# EAGLE design Breakouts2 (EAGLE 7.4.0)
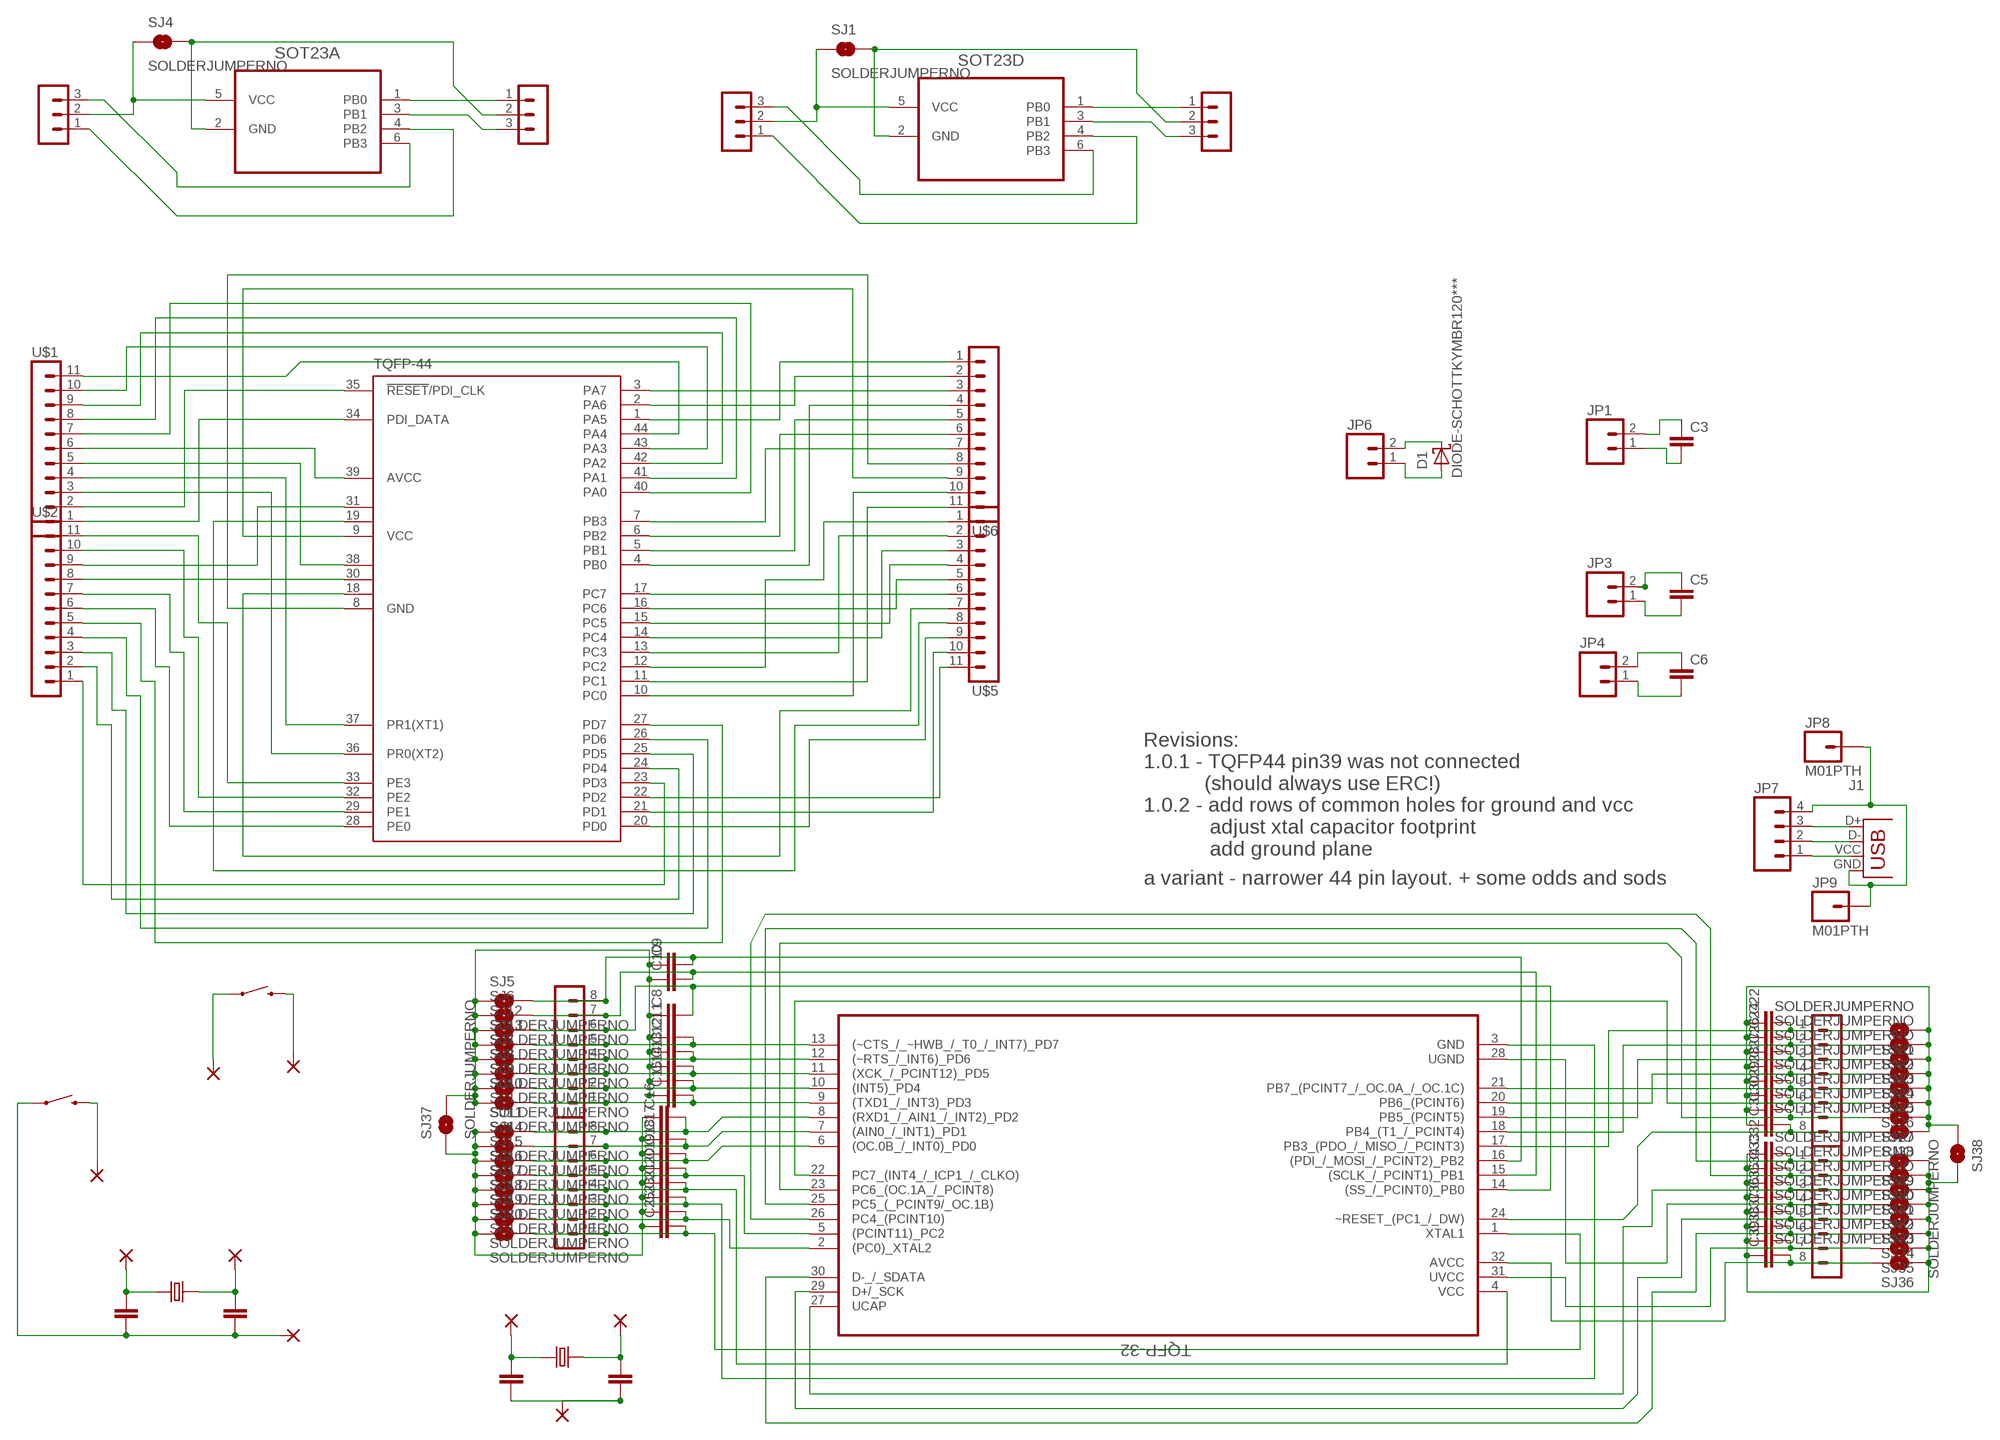
[diagram p0: schematic, sheet 1]

## Parts
C1  C-EU025-024X044**100NF+22PF  [C025-024X044]
C2  C-EU025-024X044**100NF+22PF  [C025-024X044]
C3  C-EU1206  [1206]
C5  C-EU1206  [1206]
C6  C-EU1206  [1206]
C8  C-EU1206  [1206]
C9  C-EU1206  [1206]
C10  C-EU1206  [1206]
C11  C-EU1206  [1206]
C12  C-EU1206  [1206]
C13  C-EU1206  [1206]
C14  C-EU1206  [1206]
C15  C-EU1206  [1206]
C16  C-EU1206  [1206]
C17  C-EU1206  [1206]
C18  C-EU1206  [1206]
C19  C-EU1206  [1206]
C20  C-EU1206  [1206]
C21  C-EU1206  [1206]
C22  C-EU1206  [1206]
C23  C-EU1206  [1206]
C24  C-EU1206  [1206]
C25  C-EU1206  [1206]
C26  C-EU1206  [1206]
C27  C-EU1206  [1206]
C28  C-EU1206  [1206]
C29  C-EU1206  [1206]
C30  C-EU1206  [1206]
C31  C-EU1206  [1206]
C32  C-EU1206  [1206]
C33  C-EU1206  [1206]
C34  C-EU1206  [1206]
C35  C-EU1206  [1206]
C36  C-EU1206  [1206]
C37  C-EU1206  [1206]
C38  C-EU1206  [1206]
C39  C-EU1206  [1206]
C40  C-EU025-024X044**100NF+22PF  [C025-024X044]
C41  C-EU025-024X044**100NF+22PF  [C025-024X044]
D1  DIODE-SCHOTTKYMBR120***  [SOD123]
J1  USB-FCI_SMD***  [FCI_USB_B_SMD]
JP1  M02PTH  [1X02]
JP3  M02PTH  [1X02]
JP4  M02PTH  [1X02]
JP6  M02PTH  [1X02]
JP7  M04PTH  [1X04]
JP8  M01PTH  [1X01]
JP9  M01PTH  [1X01]
PAD1  WIREPAD1,6/0,8  [1,6/0,8]
PAD2  WIREPAD1,6/0,8  [1,6/0,8]
PAD3  WIREPAD1,6/0,8  [1,6/0,8]
PAD4  WIREPAD1,6/0,8  [1,6/0,8]
PAD5  WIREPAD1,6/0,8  [1,6/0,8]
PAD6  WIREPAD1,6/0,8  [1,6/0,8]
PAD7  WIREPAD1,6/0,8  [1,6/0,8]
PAD8  WIREPAD1,6/0,8  [1,6/0,8]
PAD9  WIREPAD1,6/0,8  [1,6/0,8]
S1  SWITCH-MOMENTARY-2PTH  [TACTILE-PTH]
S2  SWITCH-MOMENTARY-2PTH  [TACTILE-PTH]
SJ1  SOLDERJUMPERNO  [SJ_2S-NO]
SJ4  SOLDERJUMPERNO  [SJ_2S-NO]
SJ5  SOLDERJUMPERNO  [SJ_2S-NO]
SJ6  SOLDERJUMPERNO  [SJ_2S-NO]
SJ7  SOLDERJUMPERNO  [SJ_2S-NO]
SJ8  SOLDERJUMPERNO  [SJ_2S-NO]
SJ9  SOLDERJUMPERNO  [SJ_2S-NO]
SJ10  SOLDERJUMPERNO  [SJ_2S-NO]
SJ11  SOLDERJUMPERNO  [SJ_2S-NO]
SJ12  SOLDERJUMPERNO  [SJ_2S-NO]
SJ13  SOLDERJUMPERNO  [SJ_2S-NO]
SJ14  SOLDERJUMPERNO  [SJ_2S-NO]
SJ15  SOLDERJUMPERNO  [SJ_2S-NO]
SJ16  SOLDERJUMPERNO  [SJ_2S-NO]
SJ17  SOLDERJUMPERNO  [SJ_2S-NO]
SJ18  SOLDERJUMPERNO  [SJ_2S-NO]
SJ19  SOLDERJUMPERNO  [SJ_2S-NO]
SJ20  SOLDERJUMPERNO  [SJ_2S-NO]
SJ21  SOLDERJUMPERNO  [SJ_2S-NO]
SJ22  SOLDERJUMPERNO  [SJ_2S-NO]
SJ23  SOLDERJUMPERNO  [SJ_2S-NO]
SJ24  SOLDERJUMPERNO  [SJ_2S-NO]
SJ25  SOLDERJUMPERNO  [SJ_2S-NO]
SJ26  SOLDERJUMPERNO  [SJ_2S-NO]
SJ27  SOLDERJUMPERNO  [SJ_2S-NO]
SJ28  SOLDERJUMPERNO  [SJ_2S-NO]
SJ29  SOLDERJUMPERNO  [SJ_2S-NO]
SJ30  SOLDERJUMPERNO  [SJ_2S-NO]
SJ31  SOLDERJUMPERNO  [SJ_2S-NO]
SJ32  SOLDERJUMPERNO  [SJ_2S-NO]
SJ33  SOLDERJUMPERNO  [SJ_2S-NO]
SJ34  SOLDERJUMPERNO  [SJ_2S-NO]
SJ35  SOLDERJUMPERNO  [SJ_2S-NO]
SJ36  SOLDERJUMPERNO  [SJ_2S-NO]
SJ37  SOLDERJUMPERNO  [SJ_2S-NO]
SJ38  SOLDERJUMPERNO  [SJ_2S-NO]
SOT23A  ATTINY10-TSHR  [SOT95P280X145-6N]
SOT23D  ATTINY10-TSHR  [SOT95P280X145-6N]
SV4  MA08-1  [MA08-1]
SV8  MA08-1  [MA08-1]
SV12  MA03-1  [MA03-1]
SV13  MA03-1  [MA03-1]
SV14  MA03-1  [MA03-1]
SV15  MA03-1  [MA03-1]
SV16  MA08-1  [MA08-1]
SV18  MA08-1  [MA08-1]
TQFP-32  AT90USB162-16AU  [QFP80P900X900X120-32N]
TQFP-44  XMEGA16A4A  [TQFP44]
U$1  MA11-1  [MA11-1S]
U$2  MA11-1  [MA11-1S]
U$5  MA11-1  [MA11-1S]
U$6  MA11-1  [MA11-1S]
X1  CRYSTAL-HC49U-V**16MHZ  [HC49U-V]
X2  CRYSTAL-HC49U-V**16MHZ  [HC49U-V]

## Nets
GND: C1.2 C2.2 PAD8.1(P) S1.1
GND1: PAD4.1(P) S2.1
N$1: TQFP-44.1(PA5) U$6.1
N$2: TQFP-44.2(PA6) U$6.2
N$3: TQFP-44.3(PA7) U$6.3
N$4: TQFP-44.4(PB0) U$6.4
N$5: TQFP-44.5(PB1) U$6.5
N$6: TQFP-44.6(PB2) U$6.6
N$7: TQFP-44.7(PB3) U$6.7
N$8: TQFP-44.8(GND) U$6.8
N$9: TQFP-44.9(VCC) U$6.9
N$10: TQFP-44.12(PC2) U$5.1
N$11: TQFP-44.11(PC1) U$6.11
N$12: TQFP-44.10(PC0) U$6.10
N$13: TQFP-44.13(PC3) U$5.2
N$14: TQFP-44.14(PC4) U$5.3
N$15: TQFP-44.15(PC5) U$5.4
N$16: TQFP-44.16(PC6) U$5.5
N$17: TQFP-44.17(PC7) U$5.6
N$18: TQFP-44.18(GND1) U$5.7
N$19: TQFP-44.19(VCC1) U$5.8
N$20: TQFP-44.20(PD0) U$5.9
N$21: TQFP-44.21(PD1) U$5.10
N$22: TQFP-44.22(PD2) U$5.11
N$23: TQFP-44.23(PD3) U$2.1
N$24: TQFP-44.24(PD4) U$2.2
N$25: C8.1 C9.1 C10.1 C11.1 C12.1 C13.1 C14.1 C15.1 SJ5.1 SJ6.1 SJ7.1 SJ8.1 SJ9.1 SJ10.1 SJ12.1 SJ13.1 SJ37.2
N$26: C24.2 SJ22.2 SV4.2 TQFP-32.18(PB4_(T1_/_PCINT4))
N$27: C22.1 C24.1 C26.1 C27.1 C28.1 C29.1 C30.1 C31.1 SJ21.1 SJ22.1 SJ23.1 SJ24.1 SJ25.1 SJ26.1 SJ27.1 SJ28.1 SJ38.1
N$28: C32.1 C33.1 C34.1 C35.1 C36.1 C37.1 C38.1 C39.1 SJ29.1 SJ30.1 SJ31.1 SJ32.1 SJ33.1 SJ34.1 SJ35.1 SJ36.1 SJ38.2
N$29: C26.2 SJ23.2 SV4.3 TQFP-32.19(PB5_(PCINT5))
N$30: C16.1 C17.1 C18.1 C19.1 C20.1 C21.1 C23.1 C25.1 SJ11.1 SJ14.1 SJ15.1 SJ16.1 SJ17.1 SJ18.1 SJ19.1 SJ20.1 SJ37.1
N$31: C27.2 SJ24.2 SV4.4 TQFP-32.20(PB6_(PCINT6))
N$32: J1.GND JP7.4 JP8.1 JP9.1
N$33: TQFP-44.25(PD5) U$2.3
N$34: TQFP-44.26(PD6) U$2.4
N$35: TQFP-44.27(PD7) U$2.5
N$36: TQFP-44.28(PE0) U$2.6
N$37: TQFP-44.29(PE1) U$2.7
N$38: TQFP-44.30(GND2) U$2.8
N$39: TQFP-44.31(VCC2) U$2.9
N$40: TQFP-44.32(PE2) U$2.10
N$41: TQFP-44.33(PE3) U$2.11
N$42: TQFP-44.34(PDI_DATA) U$1.1
N$43: TQFP-44.35(!RESET!/PDI_CLK) U$1.2
N$44: TQFP-44.36(PR0(XT2)) U$1.3
N$45: TQFP-44.37(PR1(XT1)) U$1.4
N$46: C41.1 PAD2.1(P) X2.1
N$47: C40.1 PAD5.1(P) X2.2
N$48: J1.D+ JP7.3
N$49: J1.D- JP7.2
N$50: J1.VCC(VBUS) JP7.1
N$51: PAD3.1(P) S2.3
N$52: C3.1 JP1.2
N$53: C3.2 JP1.1
N$56: C5.1 JP3.2
N$57: C5.2 JP3.1
N$58: D1.K(C) JP6.2
N$59: D1.A JP6.1
N$60: C6.1 JP4.2
N$61: C6.2 JP4.1
N$65: TQFP-44.38(GND3) U$1.5
N$66: TQFP-44.39(AVCC) U$1.6
N$67: TQFP-44.40(PA0) U$1.7
N$68: TQFP-44.41(PA1) U$1.8
N$69: TQFP-44.42(PA2) U$1.9
N$70: TQFP-44.43(PA3) U$1.10
N$71: TQFP-44.44(PA4) U$1.11
N$73: C23.2 SJ19.2 SV16.2 TQFP-32.2((PC0)_XTAL2)
N$74: C25.2 SJ20.2 SV16.1 TQFP-32.1(XTAL1)
N$75: C19.2 SJ16.2 SV16.5 TQFP-32.5((PCINT11)_PC2)
N$76: C18.2 SJ15.2 SV16.6 TQFP-32.6((OC.0B_/_INT0)_PD0)
N$77: C17.2 SJ14.2 SV16.7 TQFP-32.7((AIN0_/_INT1)_PD1)
N$78: C16.2 SJ11.2 SV16.8 TQFP-32.8((RXD1_/_AIN1_/_INT2)_PD2)
N$79: C15.2 SJ10.2 SV18.1 TQFP-32.9((TXD1_/_INT3)_PD3)
N$80: C14.2 SJ9.2 SV18.2 TQFP-32.10((INT5)_PD4)
N$81: C13.2 SJ8.2 SV18.3 TQFP-32.11((XCK_/_PCINT12)_PD5)
N$82: C12.2 SJ7.2 SV18.4 TQFP-32.12((~RTS_/_INT6)_PD6)
N$83: C11.2 SJ13.2 SV18.5 TQFP-32.13((~CTS_/_~HWB_/_T0_/_INT7)_PD7)
N$84: C20.2 SJ17.2 SV16.4 TQFP-32.4(VCC)
N$85: C21.2 SJ18.2 SV16.3 TQFP-32.3(GND)
N$86: C9.2 SJ5.2 SV18.8 TQFP-32.16((PDI_/_MOSI_/_PCINT2)_PB2)
N$87: C10.2 SJ6.2 SV18.7 TQFP-32.15((SCLK_/_PCINT1)_PB1)
N$88: C8.2 SJ12.2 SV18.6 TQFP-32.14((SS_/_PCINT0)_PB0)
N$89: C22.2 SJ21.2 SV4.1 TQFP-32.17(PB3_(PDO_/_MISO_/_PCINT3))
N$93: C28.2 SJ25.2 SV4.5 TQFP-32.21(PB7_(PCINT7_/_OC.0A_/_OC.1C))
N$94: C29.2 SJ26.2 SV4.6 TQFP-32.22(PC7_(INT4_/_ICP1_/_CLKO))
N$95: C30.2 SJ27.2 SV4.7 TQFP-32.23(PC6_(OC.1A_/_PCINT8))
N$96: C31.2 SJ28.2 SV4.8 TQFP-32.24(~RESET_(PC1_/_DW))
N$97: C32.2 SJ29.2 SV8.1 TQFP-32.25(PC5_(_PCINT9/_OC.1B))
N$98: C33.2 SJ30.2 SV8.2 TQFP-32.26(PC4_(PCINT10))
N$99: C34.2 SJ31.2 SV8.3 TQFP-32.27(UCAP)
N$100: C35.2 SJ32.2 SV8.4 TQFP-32.28(UGND)
N$101: C36.2 SJ33.2 SV8.5 TQFP-32.29(D+/_SCK)
N$102: C37.2 SJ34.2 SV8.6 TQFP-32.30(D-_/_SDATA)
N$103: C38.2 SJ35.2 SV8.7 TQFP-32.31(UVCC)
N$104: C39.2 SJ36.2 SV8.8 TQFP-32.32(AVCC)
N$153: SOT23D.1(PB0) SV13.1
N$154: SJ1.2 SOT23D.2(GND) SV13.2
N$155: SOT23D.3(PB1) SV13.3
N$156: SOT23D.4(PB2) SV12.1
N$157: SJ1.1 SOT23D.5(VCC) SV12.2
N$158: SOT23D.6(PB3) SV12.3
N$159: SOT23A.1(PB0) SV15.1
N$160: SJ4.2 SOT23A.2(GND) SV15.2
N$161: SOT23A.3(PB1) SV15.3
N$162: SOT23A.4(PB2) SV14.1
N$163: SJ4.1 SOT23A.5(VCC) SV14.2
N$164: SOT23A.6(PB3) SV14.3
N$166: PAD1.1(P) S1.3
N$169: C2.1 PAD6.1(P) X1.1
N$170: C1.1 PAD7.1(P) X1.2
XTAL_GND: C40.2 C41.2 PAD9.1(P)

## Notes on the sheet
- Revisions:
  1.0.1 - TQFP44 pin39 was not connected
             (should always use ERC!)
  1.0.2 - add rows of common holes for ground and vcc
              adjust xtal capacitor footprint
              add ground plane
- a variant - narrower 44 pin layout. + some odds and sods

## Library data of the parts
C1 C2 C40 C41 = Astronomical Clocks old:C-EU: CAPACITOR, European symbol
C3 C5 C6 C8-C39 = Master2:C-EU: CAPACITOR, European symbol
D1 = Master2:DIODE-SCHOTTKY: DIODE high speed (Philips)
J1 = Master2:USB: USB Connectors USB-B-PTH is fully proven SKU : PRT-00139 USB-miniB is fully proven SKU : PRT-00587 USB-A-PCB is untested. USB-A-H is throughly reviewed, but untested. Spark Fun Electronics SKU : PRT-00437 USB-B-SMT is throughly reviewed, but untested. Needs silkscreen touching up. USB-A-S has not been used/tested USB-MB-H has not been used/tested
JP1 JP3 JP4 JP6 = SparkFun-Connectors:M02: Header 2 Standard 2-pin 0.1" header. Use with straight break away headers (SKU : PRT-00116), right angle break away headers (PRT-00553), swiss pins (PRT-00743), machine pins (PRT-00117), and female headers (PRT-00115). Molex polarized connector foot print use with SKU : PRT-08233 with associated crimp pins and housings.
JP7 = SparkFun-Connectors:M04: Header 4 Standard 4-pin 0.1" header. Use with straight break away headers (SKU : PRT-00116), right angle break away headers (PRT-00553), swiss pins (PRT-00743), machine pins (PRT-00117), and female headers (PRT-00115). Molex polarized connector foot print use with SKU : PRT-08231 with associated crimp pins and housings. 1MM SMD Version SKU: PRT-10208
JP8 JP9 = SparkFun-Connectors:M01: Header 1 Standard 1-pin 0.1" header. Use with straight break away headers (SKU : PRT-00116), right angle break away headers (PRT-00553), swiss pins (PRT-00743), machine pins (PRT-00117), and female headers (PRT-00115).
PAD1-PAD9 = Astronomical Clocks old:WIREPAD: Wire PAD connect wire on PCB
S1 S2 = SMD Pads:SWITCH-MOMENTARY-2: Various NO switches- pushbuttons, reed, etc
SJ1 SJ4-SJ38 = Astronomical Clocks:SOLDERJUMPER: Solder Jumper Standard SMD solder jumper. Used to automate production. Two varients : Normally Open and Normally Closed are the same, but have different paste layers. NC will have a large amount of paste and should jumper during reflow.
SOT23A SOT23D = Atmel_By_element14_Batch_1:ATTINY10-TSHR: 8-bit Microcontroller with In-System Programmable Flash; MPN: ATTINY10-TSHR; OC_FARNELL: 1748538; OC_NEWARK: 26R5645; PACKAGE: SOT-23-6; SUPPLIER: Atmel
SV4 SV8 SV16 SV18 = SMD Pads:MA08-1: PIN HEADER; OC_FARNELL: unknown; OC_NEWARK: unknown
SV12-SV15 = SMD Pads:MA03-1: PIN HEADER; OC_FARNELL: unknown; OC_NEWARK: unknown
TQFP-32 = Atmel_By_element14_Batch_1:AT90USB162-16AU: 8-bit Microcontroller; MPN: AT90USB162-16AU; OC_FARNELL: 1455073; OC_NEWARK: 58M3868; PACKAGE: TQFP-32; SUPPLIER: Atmel
TQFP-44 = atmel:XMEGA16A4: MICROCONTROLLER Features High-performance, Low-power 8/16-bit AVR XMEGA Microcontroller Non-Volatile Program and Data Memories - 16 KB - 128 KB of In-System Self-Programmable Flash - 4 KB - 8 KB Boot Code Section with Independent Lock Bits - 1 KB - 2 KB EEPROM - 2 KB - 8 KB Internal SRAM Peripheral Features - Four-channel DMA Controller with support for external requests - Eight-channel Event System - Five 16-bit Timer/Counters Three Timer/Counters with 4 Output Compare or Input Capture channels Two Timer/Counters with 2 Output Compare or Input Capture channels High-Resolution Extensions on all Timer/Counters Advanced Waveform Extension on one Timer/Counter - Five USARTs IrDA Extension on one USART - Two Two-Wire Interfaces with dual address match (I2C and SMBus compatible) - Two SPIs (Serial Peripheral Interfaces) peripherals - AES and DES Crypto Engine - 16-bit Real Time Counter with Separate Oscillator - One Twelve-channel, 12-bit, 2 Msps Analog to Digital Converter - One Two-channel, 12-bit, 1 Msps Digital to Analog Converter - Two Analog Comparators with Window compare function - External Interrupts on all General Purpose I/O pins - Programmable Watchdog Timer with Separate On-chip Ultra Low Power Oscillator Special Microcontroller Features - Power-on Reset and Programmable Brown-out Detection - Internal and External Clock Options with PLL - Programmable Multi-level Interrupt Controller - Sleep Modes: Idle, Power-down, Standby, Power-save, Extended Standby - Advanced Programming, Test and Debugging Interfaces PDI (Program and Debug Interface) for programming, test and debugging I/O and Packages - 34 Programmable I/O Lines - 44 - lead TQFP - 44 - pad VQFN/QFN - 49 - ball VFBGA Operating Voltage - 1.6 - 3.6V Speed performance - 0 - 12 MHz @ 1.6 - 3.6V - 0 - 32 MHz @ 2.7 - 3.6V Drawn by Dipl.-Ing. (FH) Robert Siegler Created: 27.05.09; OC_FARNELL: unknown; OC_NEWARK: unknown
U$1 U$2 U$5 U$6 = Master2:MA11-1
X1 X2 = Astronomical Clocks old:CRYSTAL*: CRYSTAL

## Board
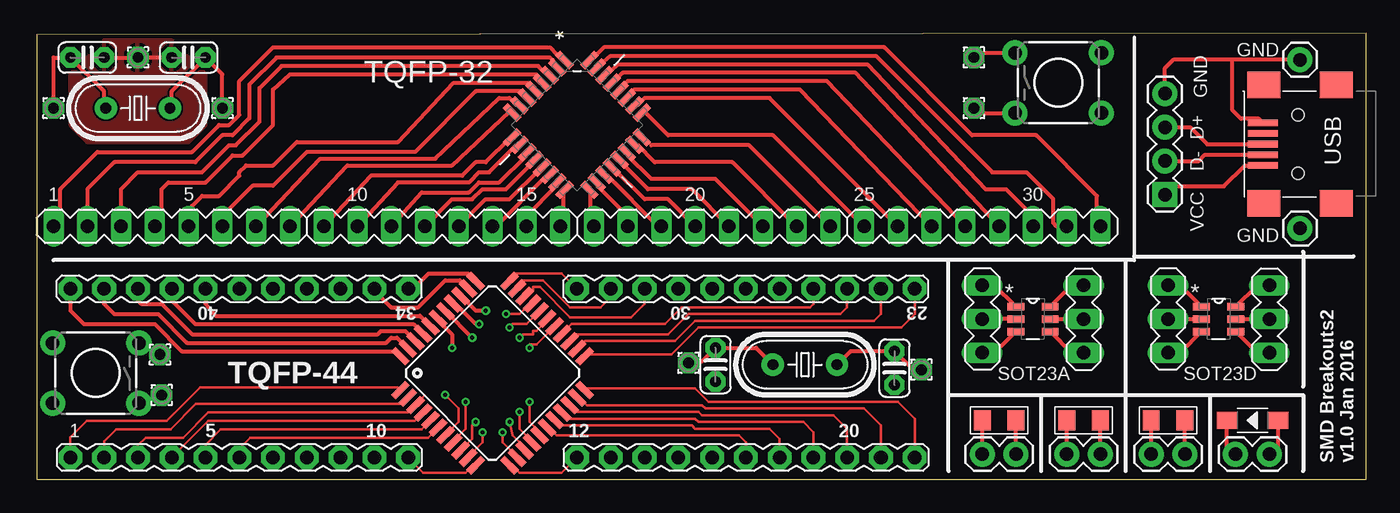
[diagram p1: board, top side]
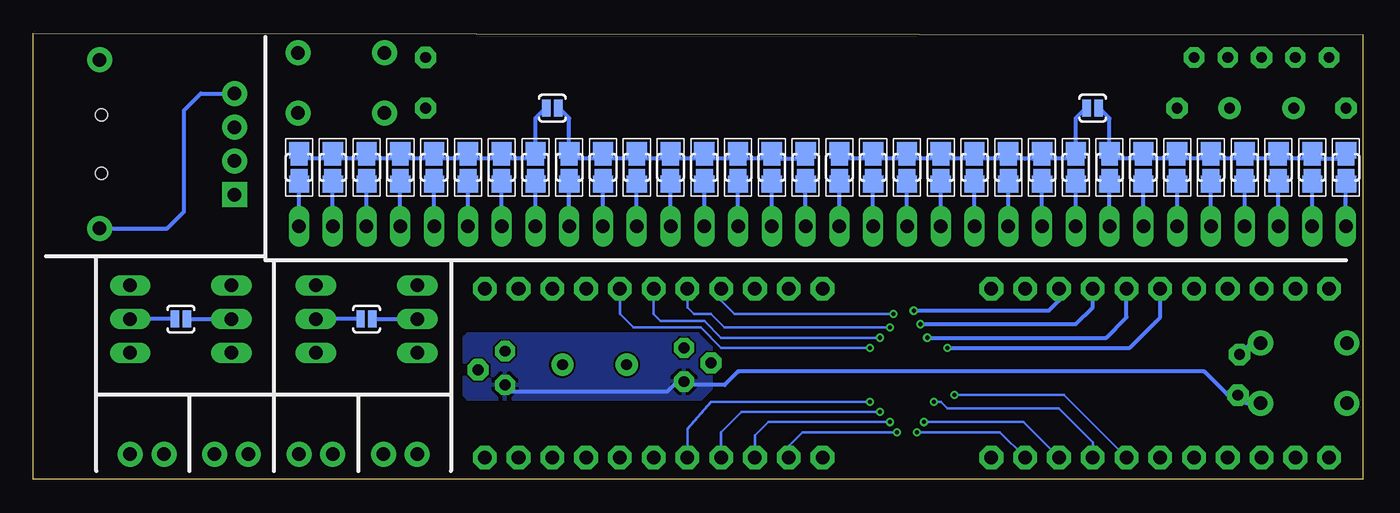
[diagram p2: board, bottom side, seen from below]

Size 100 x 33.58 mm. Coordinates in mm from the lower left corner, seen from the top.
Outline: 0,0 100,0 100,33.58 0,33.48 0,0
Copper layers (1*16): Top 0.035mm / dielectric 1.5mm / Bottom 0.035mm
Design rules "SeeedStudio_2layer_DRU_no_angle_20140221": minimum track width 6mil, minimum drill 12mil, track to track 6mil, track to pad 6mil, pad to pad 6mil, via to via 6mil, smd to smd 0mil, copper to edge 10mil, drill to drill 10mil, minimum pad ring 10mil, minimum via ring 6mil, stop-mask expansion 2mil, vias tented up to drill 100mil, thermal gap 10mil
tRestrict: 2 lines
bRestrict: 2 lines

### Footprints (pad centres in the part's own frame; a part is rotated, then mirrored left to right if it is on the bottom)
C025-024X044 = drill 0.813 pad 1.524 octagon: 1 -1.27,0; 2 1.27,0
1206 = smd 1.27 x 1.524: 1 -1.27,0; 2 1.27,0
SOD123 = smd 1.5 x 1.25: A 1.93,0; K -1.93,0
FCI_USB_B_SMD = smd 0.5 x 2.25: D+ 0,8.525; D- -0.8,8.525; GND 1.6,8.525; ID 0.8,8.525; VCC -1.6,8.525 | smd 2 x 2.5: SH$1 -4.45,8.43; SH$2 4.45,8.43; SH$3 4.45,2.98; SH$4 -4.45,2.98 | hole 0.9: -2.2,5.85; 2.2,5.85
1X02 = drill 1.016 pad 1.88: 1 0,0; 2 2.54,0
1X04 = drill 1.016 pad 1.88 square: 1 0,0 | drill 1.016 pad 1.88: 2 2.54,0; 3 5.08,0; 4 7.62,0
1X01 = drill 1.016 pad 1.88: 1 0,0
1,6/0,8 = drill 0.813 pad 1.6 octagon: 1 0,0
TACTILE-PTH = drill 1.016 pad 1.88: 1 -3.251,2.261; 2 3.251,2.261; 3 -3.251,-2.261; 4 3.251,-2.261
SJ_2S-NO = smd 0.635 x 1.27: 1 -0.45,0; 2 0.45,0
SOT95P280X145-6N = smd 1.27 x 0.559: 1 -1.295,0.94; 2 -1.295,0; 3 -1.295,-0.94; 4 1.295,-0.94; 5 1.295,0; 6 1.295,0.94
MA08-1 = drill 1.016 long: 1 -8.89,0; 2 -6.35,0; 3 -3.81,0; 4 -1.27,0; 5 1.27,0; 6 3.81,0; 7 6.35,0; 8 8.89,0
MA03-1 = drill 1.016 long: 1 -2.54,0; 2 0,0; 3 2.54,0
QFP80P900X900X120-32N = smd 1.473 x 0.508: 1 -4.115,2.794; 2 -4.115,2.007; 3 -4.115,1.194; 4 -4.115,0.406; 5 -4.115,-0.406; 6 -4.115,-1.194; 7 -4.115,-2.007; 8 -4.115,-2.794; 17 4.115,-2.794; 18 4.115,-2.007; 19 4.115,-1.194; 20 4.115,-0.406; 21 4.115,0.406; 22 4.115,1.194; 23 4.115,2.007; 24 4.115,2.794 | smd 0.508 x 1.473: 9 -2.794,-4.115; 10 -2.007,-4.115; 11 -1.194,-4.115; 12 -0.406,-4.115; 13 0.406,-4.115; 14 1.194,-4.115; 15 2.007,-4.115; 16 2.794,-4.115; 25 2.794,4.115; 26 2.007,4.115; 27 1.194,4.115; 28 0.406,4.115; 29 -0.406,4.115; 30 -1.194,4.115; 31 -2.007,4.115; 32 -2.794,4.115
TQFP44 = smd 1.5 x 0.5: 1 -5.8,4; 2 -5.8,3.2; 3 -5.8,2.4; 4 -5.8,1.6; 5 -5.8,0.8; 6 -5.8,0; 7 -5.8,-0.8; 8 -5.8,-1.6; 9 -5.8,-2.4; 10 -5.8,-3.2; 11 -5.8,-4; 23 5.8,-4; 24 5.8,-3.2; 25 5.8,-2.4; 26 5.8,-1.6; 27 5.8,-0.8; 28 5.8,0; 29 5.8,0.8; 30 5.8,1.6; 31 5.8,2.4; 32 5.8,3.2; 33 5.8,4 | smd 0.5 x 1.5: 12 -4,-5.8; 13 -3.2,-5.8; 14 -2.4,-5.8; 15 -1.6,-5.8; 16 -0.8,-5.8; 17 0,-5.8; 18 0.8,-5.8; 19 1.6,-5.8; 20 2.4,-5.8; 21 3.2,-5.8; 22 4,-5.8; 34 4,5.8; 35 3.2,5.8; 36 2.4,5.8; 37 1.6,5.8; 38 0.8,5.8; 39 0,5.8; 40 -0.8,5.8; 41 -1.6,5.8; 42 -2.4,5.8; 43 -3.2,5.8; 44 -4,5.8
MA11-1S = drill 1.016 pad 1.778 octagon: 1 -12.7,0; 2 -10.16,0; 3 -7.62,0; 4 -5.08,0; 5 -2.54,0; 6 0,0; 7 2.54,0; 8 5.08,0; 9 7.62,0; 10 10.16,0; 11 12.7,0
HC49U-V = drill 0.813 pad 1.676: 1 -2.413,0; 2 2.413,0

### Placement (x,y rotation side)
C1  64.52,8.38 270 top
C2  51.05,8.64 270 top
C3  85.09,4.45 0 top
C5  78.74,4.45 0 top
C6  72.39,4.45 0 top
C8  34.29,23.5 270 bottom
C9  39.37,23.5 270 bottom
C10  36.83,23.5 270 bottom
C11  31.75,23.5 270 bottom
C12  29.21,23.5 270 bottom
C13  26.67,23.5 270 bottom
C14  24.13,23.5 270 bottom
C15  21.59,23.5 270 bottom
C16  19.05,23.5 270 bottom
C17  16.51,23.5 270 bottom
C18  13.97,23.5 270 bottom
C19  11.43,23.5 270 bottom
C20  8.89,23.5 270 bottom
C21  6.35,23.5 270 bottom
C22  41.91,23.5 270 bottom
C23  3.81,23.5 270 bottom
C24  44.45,23.5 270 bottom
C25  1.27,23.5 270 bottom
C26  46.99,23.5 270 bottom
C27  49.53,23.5 270 bottom
C28  52.07,23.5 270 bottom
C29  54.61,23.5 270 bottom
C30  57.15,23.5 270 bottom
C31  59.69,23.5 270 bottom
C32  62.23,23.5 270 bottom
C33  64.77,23.5 270 bottom
C34  67.31,23.5 270 bottom
C35  69.85,23.5 270 bottom
C36  72.39,23.5 270 bottom
C37  74.93,23.5 270 bottom
C38  77.47,23.5 270 bottom
C39  80.01,23.5 270 bottom
C40  11.43,31.75 180 top
C41  3.81,31.75 0 top
D1  91.44,4.45 0 top
J1  100.73,25.23 90 top
JP1  86.36,1.91 180 top
JP3  80.01,1.91 180 top
JP4  73.66,1.91 180 top
JP6  92.71,1.91 180 top
JP7  84.86,21.43 90 top
JP8  95.02,18.89 0 top
JP9  95.02,31.59 90 top
PAD1  9.27,9.4 0 top
PAD2  1.27,27.94 0 top
PAD3  70.48,27.94 0 top
PAD4  70.48,31.75 0 top
PAD5  13.97,27.94 0 top
PAD6  49.02,8.76 0 top
PAD7  66.55,8.26 0 top
PAD8  9.4,6.35 0 top
PAD9  7.62,31.75 0 top
S1  4.45,8 180 top
S2  76.83,29.84 0 top
SJ1  88.9,12.06 0 bottom
SJ4  74.93,12.06 0 bottom
SJ5  39.37,23.5 270 bottom
SJ6  36.83,23.5 270 bottom
SJ7  29.21,23.5 270 bottom
SJ8  26.67,23.5 270 bottom
SJ9  24.13,23.5 270 bottom
SJ10  21.59,23.5 270 bottom
SJ11  19.05,23.5 270 bottom
SJ12  34.29,23.5 270 bottom
SJ13  31.75,23.5 270 bottom
SJ14  16.51,23.5 270 bottom
SJ15  13.97,23.5 270 bottom
SJ16  11.43,23.5 270 bottom
SJ17  8.89,23.5 270 bottom
SJ18  6.35,23.5 270 bottom
SJ19  3.81,23.5 270 bottom
SJ20  1.27,23.5 270 bottom
SJ21  41.91,23.5 270 bottom
SJ22  44.45,23.5 270 bottom
SJ23  46.99,23.5 270 bottom
SJ24  49.53,23.5 270 bottom
SJ25  52.07,23.5 270 bottom
SJ26  54.61,23.5 270 bottom
SJ27  57.15,23.5 270 bottom
SJ28  59.69,23.5 270 bottom
SJ29  62.23,23.5 270 bottom
SJ30  64.77,23.5 270 bottom
SJ31  67.31,23.5 270 bottom
SJ32  69.85,23.5 270 bottom
SJ33  72.39,23.5 270 bottom
SJ34  74.93,23.5 270 bottom
SJ35  77.47,23.5 270 bottom
SJ36  80.01,23.5 270 bottom
SJ37  20.32,27.94 180 bottom
SJ38  60.96,27.94 180 bottom
SOT23A  74.93,12.06 0 top
SOT23D  88.9,12.06 0 top
SV4  50.8,19.05 0 top
SV8  71.12,19.05 0 top
SV12  92.71,12.06 90 top
SV13  85.09,12.06 270 top
SV14  78.74,12.06 90 top
SV15  71.12,12.06 270 top
SV16  10.16,19.05 0 top
SV18  30.48,19.05 0 top
TQFP-32  40.64,26.67 315 top
TQFP-44  34.29,8 45 top
U$1  15.24,14.35 180 top
U$2  53.34,14.35 180 top
U$5  53.34,1.65 0 top
U$6  15.24,1.65 0 top
X1  57.78,8.64 0 top
X2  7.62,27.94 0 top

### Tracks (layer width: path | path; a pad name or v marks a point on that pad's centre or on a via)
GND
  Bottom 0.305: S1.1 8.79,5.74 PAD8.1 10.16,6.35 11.94,8.13 46.99,8.13 48.01,7.11 50.8,7.11 C2.2 51.56,7.37 52.32,6.6 64.01,6.6 C1.2
  pour Bottom: 49.02,8.64 49.02,9.91 50.04,10.92 67.31,10.92 67.56,10.67 67.56,6.35 67.31,6.1 49.78,6.1 49.02,6.86
GND1
  Top 0.305: PAD4.1 70.84,32.11 S2.1
N$1
  Top 0.203: U$6.1 2.54,3.17 3.78,4.41 9.76,4.41 12.28,6.93 27.16,6.93 TQFP-44.1
N$2
  Top 0.152: 27.69,6.1 TQFP-44.2 | 5.08,1.52 U$6.2
  Top 0.203: U$6.2 5.08,2.88 | 5.08,2.88 | 5.08,2.88 5.98,3.78 10.08,3.78 11.97,5.67 27.43,5.67 TQFP-44.2
N$3
  Top 0.152: 29.21,6.35 28.7,5.84 TQFP-44.3
  Top 0.203: U$6.3 7.62,2.58 8.19,3.15 11.02,3.15 12.91,5.04 27.93,5.04 TQFP-44.3
N$4
  Top 0.203: U$6.4 12.91,4.41 28.44,4.41 TQFP-44.4
N$5
  Top 0.203: U$6.5 12.7,2.62 13.86,3.78 28.94,3.78 TQFP-44.5
N$6
  Top 0.203: U$6.6 15.24,2.33 16.06,3.15 29.44,3.15 TQFP-44.6
N$7  (via drill 0.3 pad 0.61)
  Top 0.203: TQFP-44.7 30.77,3.33 31.75,4.32 31.75,5.33 v30.73,6.35
  Bottom 0.203: v30.73,6.35 22.48,6.35 U$6.7
N$8  (via drill 0.3 pad 0.61)
  Top 0.203: TQFP-44.8 31.32,2.87 32.26,3.81 v32.26,5.84
  Bottom 0.203: v32.26,5.84 31.75,5.84 31.24,5.33 22.86,5.33 20.32,2.79 U$6.8
N$9  (via drill 0.3 pad 0.61)
  Top 0.152: 31.5,1.78 31.75,2.03 TQFP-44.9 | 22.86,1.78 U$6.9
  Top 0.203: 31.5,1.78 32.77,3.05 32.77,4.06 v33.02,4.32
  Bottom 0.203: v33.02,4.32 25.53,4.32 U$6.9
N$10
  Top 0.203: TQFP-44.12 35.76,1.07 36.32,0.51 39.5,0.51 U$5.1
N$11
  Top 0.203: TQFP-44.11 32.82,1.07 32.26,0.51 29.08,0.51 U$6.11
N$12  (via drill 0.3 pad 0.61)
  Top 0.152: 32.26,1.52 TQFP-44.10 | 25.4,1.78 U$6.10
  Top 0.203: 32.26,1.52 33.53,2.79 v33.53,3.56
  Bottom 0.203: v33.53,3.56 27.3,3.56 U$6.10
N$13  (via drill 0.3 pad 0.61)
  Top 0.203: TQFP-44.13 36.13,1.72 35.05,2.79 v35.05,3.56
  Bottom 0.203: v35.05,3.56 42.16,3.56 43.18,2.54 U$5.2
N$14  (via drill 0.3 pad 0.61)
  Top 0.203: TQFP-44.14 36.69,2.42 35.81,3.3 v35.56,4.32
  Bottom 0.203: v35.56,4.32 44.7,4.32 45.72,3.3 U$5.3
N$15  (via drill 0.3 pad 0.61)
  Top 0.203: TQFP-44.15 37.26,2.87 36.32,3.81 v36.32,5.08
  Bottom 0.203: v36.32,5.08 46.74,5.08 48.26,3.56 U$5.4
N$16  (via drill 0.3 pad 0.61)
  Top 0.203: TQFP-44.16 37.83,3.58 37.08,4.32 v37.08,5.84
  Bottom 0.203: v37.08,5.84 49.02,5.84 50.8,3.81 U$5.5
N$17
  Top 0.203: TQFP-44.17 38.52,3.9 39.12,3.3 52.83,3.3 53.34,2.79 U$5.6
N$18
  Top 0.203: U$5.7 55.88,3.05 55.12,3.81 49.53,3.81 49.28,4.06 39.36,4.06 TQFP-44.18
N$19
  Top 0.203: TQFP-44.19 39.67,5.03 40.13,4.57 49.53,4.57 49.78,4.32 57.66,4.32 58.42,3.56 U$5.8
N$20
  Top 0.203: U$5.9 60.96,3.81 59.94,4.83 50.04,4.83 49.78,5.08 40.6,5.08 TQFP-44.20
N$21
  Top 0.203: TQFP-44.21 40.83,6.16 41.4,5.59 50.04,5.59 50.29,5.33 62.23,5.33 63.5,4.06 U$5.10
N$22
  Top 0.203: U$5.11 66.04,4.57 64.77,5.84 50.55,5.84 49.53,6.86 41.35,6.86 TQFP-44.22
N$23
  Top 0.203: U$2.1 66.04,12.45 65.02,11.43 49.78,11.43 47.75,9.4 41.34,9.4 TQFP-44.23
N$24
  Top 0.203: U$2.2 63.5,12.45 62.99,11.94 49.53,11.94 48.01,10.41 41.23,10.41 TQFP-44.24
N$25
  Bottom 0.152: C9.1 39.37,24.13 SJ5.1 | C10.1 36.83,24.13 SJ6.1 | C8.1 34.29,24.13 SJ12.1 | C11.1 31.75,24.13 SJ13.1 | C12.1 29.21,24.13 SJ7.1 | C13.1 26.67,24.13 SJ8.1 | C14.1 25.4,24.13 SJ9.1 | C15.1 21.59,24.13 SJ10.1 | 20.83,27.94 SJ37.2
  Bottom 0.305: 20.83,27.94 21.59,27.18 C15.1 | 21.59,24.13 25.4,24.13 26.67,24.13 29.21,24.13 31.75,24.13 34.29,24.13 36.83,24.13 39.37,24.13
N$26
  Top 0.152: SV4.2 44.45,19.81 | 42.16,22.1 TQFP-32.18
  Top 0.305: 44.45,19.81 42.16,22.1
  Bottom 0.152: C24.2 SJ22.2
  Bottom 0.305: SV4.2 C24.2
N$27
  Bottom 0.152: C31.1 59.69,24.13 SJ28.1 | 60.45,27.94 SJ38.1 | C30.1 57.15,24.13 SJ27.1 | C29.1 54.61,24.13 SJ26.1 | C28.1 52.07,24.13 SJ25.1 | C27.1 49.53,24.13 SJ24.1 | C26.1 46.99,24.13 SJ23.1 | C22.1 41.91,24.13 SJ21.1 | C24.1 44.45,24.13 SJ22.1
  Bottom 0.305: 60.45,27.94 59.69,27.18 C31.1 | 41.91,24.13 44.45,24.13 46.99,24.13 49.53,24.13 52.07,24.13 54.61,24.13 57.15,24.13 59.69,24.13
N$28
  Bottom 0.152: C39.1 80.01,24.13 SJ36.1 | C38.1 77.47,24.13 SJ35.1 | C37.1 74.93,24.13 SJ34.1 | C36.1 72.39,24.13 SJ33.1 | C35.1 69.85,24.13 SJ32.1 | C34.1 67.31,24.13 SJ31.1 | C33.1 64.77,24.13 SJ30.1 | C32.1 62.23,24.13 SJ29.1 | 61.47,27.94 SJ38.2
  Bottom 0.305: 61.47,27.94 62.23,27.18 C32.1 | 62.23,24.13 64.77,24.13 67.31,24.13 69.85,24.13 72.39,24.13 74.93,24.13 77.47,24.13 80.01,24.13
N$29
  Top 0.152: SV4.3 46.74,19.05 | 42.93,22.86 TQFP-32.19
  Top 0.305: 46.74,19.05 42.93,22.86
  Bottom 0.152: C26.2 SJ23.2
  Bottom 0.305: SV4.3 C26.2
N$30
  Bottom 0.152: C16.1 19.05,24.13 SJ11.1 | 19.81,27.94 SJ37.1 | C17.1 16.51,24.13 SJ14.1 | C18.1 13.97,24.13 SJ15.1 | C19.1 11.43,24.13 SJ16.1 | C20.1 8.89,24.13 SJ17.1 | C21.1 6.35,24.13 SJ18.1 | C25.1 1.27,24.13 SJ20.1 | C23.1 3.81,24.13 SJ19.1
  Bottom 0.305: 19.81,27.94 19.05,27.18 C16.1 | 1.27,24.13 3.81,24.13 6.35,24.13 8.89,24.13 11.43,24.13 13.97,24.13 16.51,24.13 19.05,24.13
N$31
  Top 0.152: 43.43,23.37 TQFP-32.20
  Top 0.305: 43.43,23.37 45.72,21.08 47.5,21.08 SV4.4
  Bottom 0.152: C27.2 SJ24.2
  Bottom 0.305: SV4.4 C27.2
N$32
  Top 0.305: JP7.4 84.86,30.95 85.49,31.59 89.94,31.59 | JP9.1 89.94,31.59 | J1.GND 91.9,27.14 90.57,27.14 89.94,27.77 89.94,31.59
  Bottom 0.305: JP8.1 89.94,18.89 88.67,20.16 88.67,27.77 87.39,29.05 JP7.4
N$33
  Top 0.203: U$2.3 60.96,12.95 60.45,12.45 49.02,12.45 47.5,10.92 40.6,10.92 TQFP-44.25
N$34
  Top 0.203: U$2.4 58.42,13.21 58.17,12.95 48.51,12.95 47.24,11.68 40.24,11.68 TQFP-44.26
N$35  (via drill 0.3 pad 0.61)
  Top 0.203: TQFP-44.27 38.96,11.53 37.59,10.16 37.08,10.16 v37.08,9.91
  Bottom 0.203: v37.08,9.91 48.26,9.91 49.78,11.43 54.86,11.43 55.88,12.45 U$2.5
N$36  (via drill 0.3 pad 0.61)
  Top 0.203: TQFP-44.28 38.39,11.97 37.59,11.18 37.34,11.18 37.34,10.92 36.58,10.92 v36.32,10.67
  Bottom 0.203: v36.32,10.67 48.26,10.67 49.53,11.94 52.83,11.94 53.34,12.45 U$2.6
N$37  (via drill 0.3 pad 0.61)
  Top 0.203: TQFP-44.29 37.81,12.67 36.83,11.68 35.81,11.68 v35.56,11.43
  Bottom 0.203: v35.56,11.43 48.01,11.43 49.02,12.45 50.29,12.45 50.8,12.95 U$2.7
N$38  (via drill 0.3 pad 0.61)
  Top 0.203: TQFP-44.30 37.11,13.23 36.32,12.45 v35.31,12.45
  Bottom 0.203: v35.31,12.45 47.24,12.45 48.26,13.46 U$2.8
N$39
  Top 0.203: TQFP-44.31 36.91,13.8 37.34,14.22 37.34,14.48 37.85,14.48 40.13,12.19 44.7,12.19 45.72,13.21 U$2.9
N$40
  Top 0.203: TQFP-44.32 36.13,14.54 36.58,14.99 38.1,14.99 40.13,12.95 42.42,12.95 43.18,13.72 U$2.10
N$41
  Top 0.203: TQFP-44.33 35.56,14.99 36.07,15.49 39.5,15.49 U$2.11
N$42
  Top 0.305: U$1.1 28.32,14.35 29.46,15.49 32.45,15.49 TQFP-44.34
N$43
  Top 0.305: U$1.2 25.4,14.22 26.67,12.95 28.7,12.95 30.73,14.99 31.83,14.99 TQFP-44.35
N$44  (via drill 0.3 pad 0.61)
  Top 0.305: U$1.3 22.86,14.22 | TQFP-44.36 31.92,13.8 33.02,12.7 v33.78,12.7
  Bottom 0.305: v33.78,12.7 23.62,12.7 22.86,13.46 U$1.3
N$45  (via drill 0.3 pad 0.61)
  Top 0.305: TQFP-44.37 31.47,13.23 33.02,11.68 v33.27,11.68
  Bottom 0.305: v33.27,11.68 21.59,11.68 20.32,12.95 U$1.4
N$46
  Top 0.305: X2.1 5.08,27.94 5.08,29.21 C41.1 1.27,31.75 PAD2.1
N$47
  Top 0.305: X2.2 10.16,27.94 10.16,29.21 C40.1 13.97,30.48 PAD5.1
N$48
  Top 0.305: JP7.3 86.76,26.5 88.03,25.23 J1.D+
N$49
  Top 0.305: JP7.2 87.39,23.96 87.86,24.43 J1.D-
N$50
  Top 0.305: JP7.1 85.49,22.06 89.3,22.06 90.88,23.64 J1.VCC
N$51
  Top 0.305: PAD3.1 70.84,27.58 S2.3
N$52
  Top 0.305: JP1.2 C3.1
N$53
  Top 0.305: JP1.1 C3.2
N$56
  Top 0.305: JP3.2 C5.1
N$57
  Top 0.305: JP3.1 C5.2
N$58
  Top 0.305: JP6.2 89.51,2.56 D1.K
N$59
  Top 0.305: JP6.1 93.37,2.56 D1.A
N$60
  Top 0.305: JP4.2 C6.1
N$61
  Top 0.305: JP4.1 C6.2
N$65  (via drill 0.3 pad 0.61)
  Top 0.305: TQFP-44.38 30.77,12.67 v32.77,10.67
  Bottom 0.305: v32.77,10.67 19.3,10.67 17.78,12.19 U$1.5
N$66  (via drill 0.3 pad 0.61)
  Top 0.305: TQFP-44.39 30.19,11.97 31.24,10.92 v31.24,9.91
  Bottom 0.305: v31.24,9.91 17.53,9.91 15.24,12.19 U$1.6
N$67
  Top 0.305: U$1.7 12.7,13.21 13.46,12.32 28.84,12.32 TQFP-44.40
N$68
  Top 0.305: U$1.8 10.16,13.46 11.94,11.68 28.34,11.68 TQFP-44.41
N$69
  Top 0.305: U$1.9 7.62,13.46 7.87,13.21 9.4,13.21 11.68,10.92 25.65,10.92 25.91,11.18 27.72,11.18 TQFP-44.42
N$70
  Top 0.305: U$1.10 5.08,13.21 5.84,12.45 9.14,12.45 11.3,10.29 26.29,10.29 26.67,10.67 27.1,10.67 TQFP-44.43
N$71
  Top 0.305: U$1.11 2.54,12.7 3.56,11.68 8.89,11.68 10.92,9.65 26.98,9.65 TQFP-44.44
N$73
  Top 0.152: 38.86,31.5 39.12,31.24 TQFP-32.2
  Top 0.305: 38.86,31.5 38.61,31.75 18.03,31.75 16,29.72 16,27.18 14.73,25.91 13.97,25.91 11.94,23.88 5.84,23.88 3.81,21.84 SV16.2
  Bottom 0.152: C23.2 SJ19.2
  Bottom 0.305: SV16.2 C23.2
N$74
  Top 0.152: 39.37,32 39.62,31.75 TQFP-32.1
  Top 0.305: SV16.1 1.78,19.56 1.78,21.84 4.57,24.64 11.68,24.64 13.72,26.67 14.48,26.67 15.24,27.43 15.24,29.97 17.78,32.51 38.61,32.51 39.12,32 39.37,32
  Bottom 0.152: C25.2 SJ20.2
  Bottom 0.305: SV16.1 C25.2
N$75
  Top 0.152: 36.96,29.84 37.34,29.46 TQFP-32.5
  Top 0.305: SV16.5 11.68,19.3 11.68,20.57 12.45,21.34 13.72,21.34 15.24,22.86 15.24,23.11 15.75,23.62 17.78,23.62 19.56,25.4 27.18,25.4 31.37,29.84 36.96,29.84
  Bottom 0.152: C19.2 SJ16.2
  Bottom 0.305: SV16.5 C19.2
N$76
  Top 0.152: 36.58,29.21 36.83,28.96 TQFP-32.6
  Top 0.305: 36.58,29.21 33.02,29.21 28.45,24.64 20.32,24.64 17.78,22.1 16.26,22.1 13.97,19.81 SV16.6
  Bottom 0.152: C18.2 SJ15.2
  Bottom 0.305: SV16.6 C18.2
N$77
  Top 0.152: 36.07,28.19 TQFP-32.7
  Top 0.305: 36.07,28.19 35.56,28.7 34.8,28.7 29.97,24.13 21.34,24.13 SV16.7
  Bottom 0.152: C17.2 SJ14.2
  Bottom 0.305: SV16.7 C17.2
N$78
  Top 0.152: 35.56,27.69 TQFP-32.8
  Top 0.305: 35.56,27.69 31.24,23.62 23.37,23.62 SV16.8
  Bottom 0.152: C16.2 SJ11.2
  Bottom 0.305: SV16.8 C16.2
N$79
  Top 0.152: 35.56,25.65 TQFP-32.9
  Top 0.305: SV18.1 25.15,22.86 32,22.86 33.02,23.88 33.78,23.88 35.56,25.65
  Bottom 0.152: C15.2 SJ10.2
  Bottom 0.305: SV18.1 C15.2
N$80
  Top 0.152: 36.07,25.15 TQFP-32.10
  Top 0.305: 36.07,25.15 34.04,23.11 33.27,23.11 32.51,22.35 27.18,22.35 SV18.2
  Bottom 0.152: C14.2 SJ9.2
  Bottom 0.305: SV18.2 C14.2
N$81
  Top 0.152: 36.83,24.38 TQFP-32.11
  Top 0.305: 36.83,24.38 34.8,22.35 33.27,22.35 32.51,21.59 28.96,21.59 SV18.3
  Bottom 0.152: C13.2 SJ8.2
  Bottom 0.305: SV18.3 C13.2
N$82
  Top 0.152: 37.34,23.88 TQFP-32.12
  Top 0.305: 37.34,23.88 35.31,21.84 33.53,21.84 32.77,21.08 31.24,21.08 SV18.4
  Bottom 0.152: C12.2 SJ7.2
  Bottom 0.305: SV18.4 C12.2
N$83
  Top 0.152: 37.85,23.37 TQFP-32.13
  Top 0.305: 37.85,23.37 35.56,21.08 33.78,21.08 SV18.5
  Bottom 0.152: C11.2 SJ13.2
  Bottom 0.305: SV18.5 C11.2
N$84
  Top 0.152: 37.59,30.48 37.85,29.97 TQFP-32.4
  Top 0.305: SV16.4 9.4,19.56 9.4,21.84 9.91,22.35 12.7,22.35 14.73,24.38 15.49,24.38 17.78,26.67 17.78,29.34 19.05,30.48 37.59,30.48
  Bottom 0.152: C20.2 SJ17.2
  Bottom 0.305: SV16.4 C20.2
N$85
  Top 0.152: 38.61,30.23 TQFP-32.3
  Top 0.305: 38.61,30.23 37.72,31.11 18.41,31.11 16.76,29.46 16.76,26.92 14.99,25.15 14.48,25.15 12.45,23.11 7.62,23.11 6.35,21.84 SV16.3
  Bottom 0.152: C21.2 SJ18.2
  Bottom 0.305: SV16.3 C21.2
N$86
  Top 0.152: SV18.8 39.62,19.05 | 39.62,21.59 TQFP-32.16
  Top 0.305: 39.62,19.05 39.62,21.59
  Bottom 0.152: C9.2 SJ5.2
  Bottom 0.305: SV18.8 C9.2
N$87
  Top 0.152: SV18.7 36.83,19.81 | 39.12,22.1 TQFP-32.15
  Top 0.305: 36.83,19.81 39.12,22.1
  Bottom 0.152: C10.2 SJ6.2
  Bottom 0.305: SV18.7 C10.2
N$88
  Top 0.152: SV18.6 34.54,19.05 | 38.35,22.86 TQFP-32.14
  Top 0.305: 34.54,19.05 38.35,22.86
  Bottom 0.152: C8.2 SJ12.2
  Bottom 0.305: SV18.6 C8.2
N$89
  Top 0.152: SV4.1 41.66,19.05 | 41.66,21.59 TQFP-32.17
  Top 0.305: 41.66,19.05 41.66,21.59
  Bottom 0.152: C22.2 SJ21.2
  Bottom 0.305: SV4.1 C22.2
N$93
  Top 0.152: 43.94,23.88 TQFP-32.21
  Top 0.305: 43.94,23.88 45.97,21.84 49.28,21.84 SV4.5
  Bottom 0.152: C28.2 SJ25.2
  Bottom 0.305: SV4.5 C28.2
N$94
  Top 0.152: 44.45,24.38 TQFP-32.22
  Top 0.305: 44.45,24.38 46.23,22.61 51.05,22.61 SV4.6
  Bottom 0.152: C29.2 SJ26.2
  Bottom 0.305: SV4.6 C29.2
N$95
  Top 0.152: 45.21,25.15 TQFP-32.23
  Top 0.305: 45.21,25.15 46.48,23.88 52.32,23.88 SV4.7
  Bottom 0.152: C30.2 SJ27.2
  Bottom 0.305: SV4.7 C30.2
N$96
  Top 0.152: 46.23,25.15 45.72,25.65 TQFP-32.24
  Top 0.305: 46.23,25.15 53.59,25.15 SV4.8
  Bottom 0.152: C31.2 SJ28.2
  Bottom 0.305: SV4.8 C31.2
N$97
  Top 0.152: 45.72,27.69 TQFP-32.25
  Top 0.305: 45.72,27.69 47.5,25.91 55.37,25.91 SV8.1
  Bottom 0.152: C32.2 SJ29.2
  Bottom 0.305: SV8.1 C32.2
N$98
  Top 0.152: 45.21,28.19 TQFP-32.26
  Top 0.305: 45.21,28.19 45.72,28.7 55.12,28.7 SV8.2
  Bottom 0.152: C33.2 SJ30.2
  Bottom 0.305: SV8.2 C33.2
N$99
  Top 0.152: 44.45,28.96 TQFP-32.27
  Top 0.305: 44.45,28.96 44.96,29.34 57.4,29.34 SV8.3
  Bottom 0.152: C34.2 SJ31.2
  Bottom 0.305: SV8.3 C34.2
N$100
  Top 0.152: 43.94,29.46 TQFP-32.28
  Top 0.305: 43.94,29.46 44.45,29.97 59.44,29.97 SV8.4
  Bottom 0.152: C35.2 SJ32.2
  Bottom 0.305: SV8.4 C35.2
N$101
  Top 0.152: 43.43,29.97 TQFP-32.29
  Top 0.305: 43.43,29.97 44.07,30.61 61.59,30.61 SV8.5
  Bottom 0.152: C36.2 SJ33.2
  Bottom 0.305: SV8.5 C36.2
N$102
  Top 0.305: TQFP-32.30 43.78,31.24 62.48,31.24 71.37,21.84 72.9,21.84 74.93,19.81 SV8.6
  Bottom 0.152: C37.2 SJ34.2
  Bottom 0.305: SV8.6 C37.2
N$103
  Top 0.152: 42.42,31.24 42.16,31.24 TQFP-32.31 | SV8.7 77.22,19.05
  Top 0.305: 77.22,19.05 76.71,19.05 76.45,19.3 76.45,21.08 74.42,23.11 71.88,23.11 63.12,31.88 43.18,31.88 42.42,31.24
  Bottom 0.152: C38.2 SJ35.2
  Bottom 0.305: SV8.7 C38.2
N$104
  Top 0.152: 41.91,32 41.66,31.75 TQFP-32.32
  Top 0.305: SV8.8 79.76,19.3 79.76,21.34 75.18,25.91 70.36,25.91 63.75,32.51 42.67,32.51 42.16,32 41.91,32
  Bottom 0.152: C39.2 SJ36.2
  Bottom 0.305: SV8.8 C39.2
N$153
  Top 0.305: SOT23D.1 86,14.61 SV13.1
N$154
  Top 0.305: SV13.2 SOT23D.2
  Bottom 0.305: SJ1.2 SV13.2
N$155
  Top 0.305: SOT23D.3 86,9.53 SV13.3
N$156
  Top 0.305: SOT23D.4 91.8,9.53 SV12.1
N$157
  Top 0.305: SOT23D.5 SV12.2
  Bottom 0.305: SJ1.1 SV12.2
N$158
  Top 0.305: SOT23D.6 91.8,14.61 SV12.3
N$159
  Top 0.305: SOT23A.1 72.03,14.61 SV15.1
N$160
  Top 0.305: SOT23A.2 SV15.2
  Bottom 0.305: SJ4.2 SV15.2
N$161
  Top 0.305: SOT23A.3 72.03,9.53 SV15.3
N$162
  Top 0.305: SOT23A.4 77.83,9.53 SV14.1
N$163
  Top 0.305: SOT23A.5 SV14.2
  Bottom 0.305: SJ4.1 SV14.2
N$164
  Top 0.305: SOT23A.6 77.83,14.61 SV14.3
N$166
  Bottom 0.305: S1.3 8.41,10.26 PAD1.1
N$169
  Top 0.152: 49.02,8.89 PAD6.1
  Top 0.305: 49.02,8.89 50.04,8.89 C2.1 54.1,9.91 X1.1
N$170
  Top 0.152: 66.55,8.38 PAD7.1
  Top 0.305: 66.55,8.38 65.79,8.38 C1.1 61.21,9.65 X1.2
XTAL_GND
  Top 0.305: C41.2 PAD9.1 C40.2
  pour Top: 3.81,25.4 11.43,25.4 12.7,26.67 12.7,30.48 10.16,33.02 5.08,33.02 2.54,30.48 2.54,26.67

### Text on the board
tPlace: GND | GND | D+ | D- | 1 | 5 | 10 | 15 | 20 | 25 | 30 | VCC | GND | 40 | 34 | 30 | 23 | 1 | 5 | 10 | 12 | 20 | SMD Breakouts2 / v1.0 Jan 2016
tNames: TQFP-44
tValues: Reset | GND